# EAGLE design testsmd (EAGLE 9.5.1)
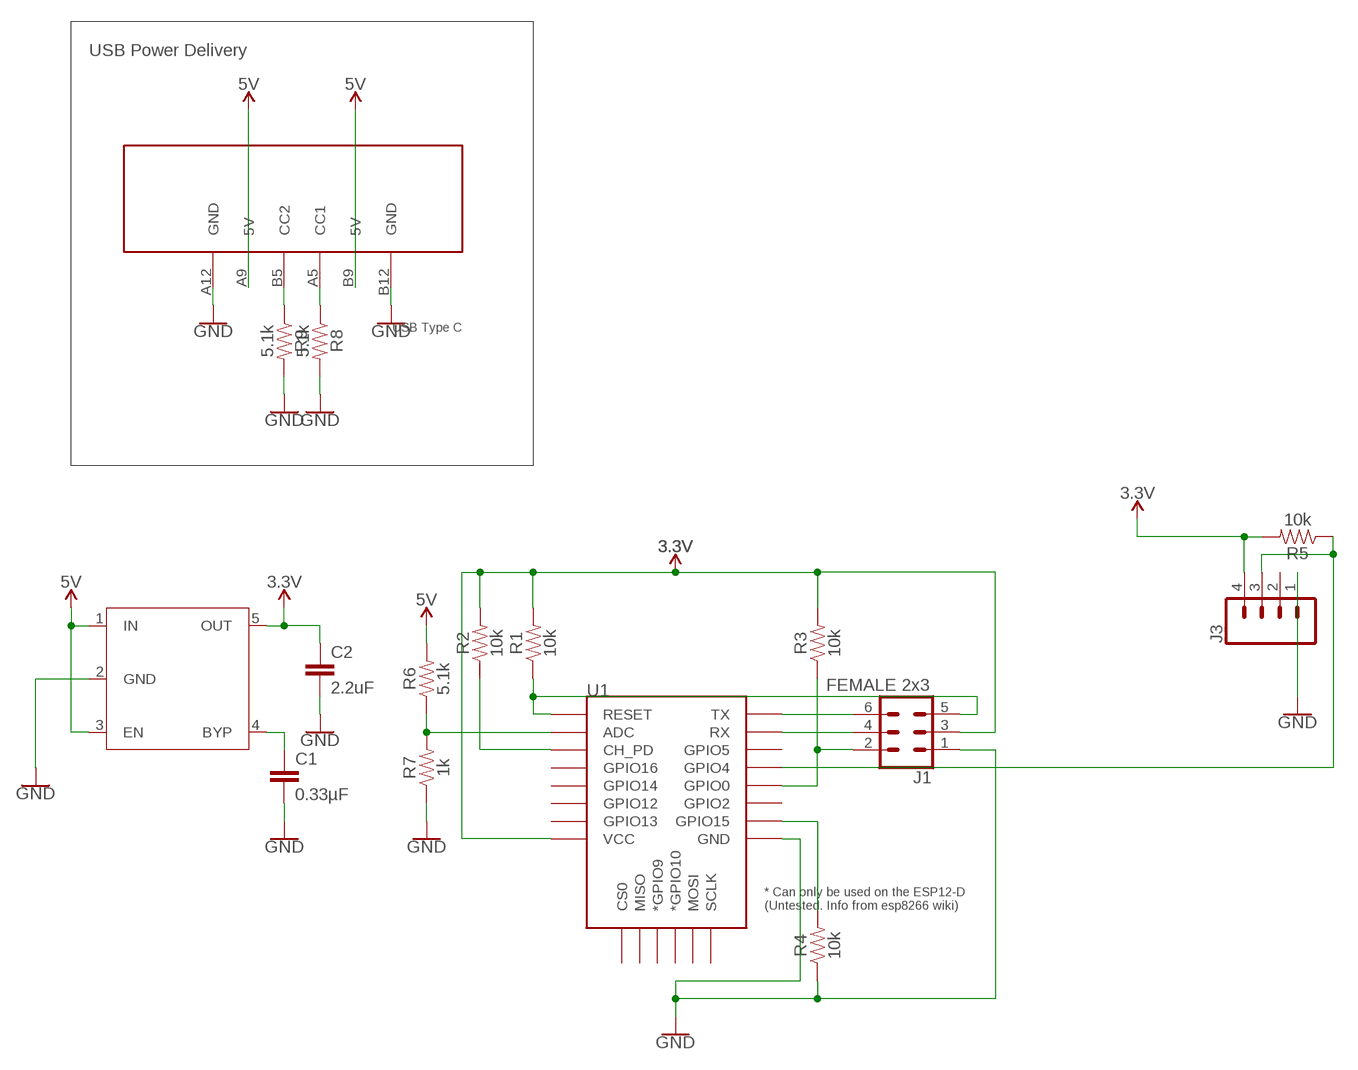
[diagram p0: schematic, sheet 1]

## Parts
C1  0.33µF  0.33UF/330NF-0805-50V-10%  [0805]
C2  2.2uF  2.2UF-1206-50V-10%  [1206]
J1  FEMALE 2x3  CONN_03X2FEMALE  [2X3]
J3  CONN_04  [1X04]
R1  10k  0.75OHM-0805-1/4W-1%  [0805]
R2  10k  0.75OHM-0805-1/4W-1%  [0805]
R3  10k  0.75OHM-0805-1/4W-1%  [0805]
R4  10k  0.75OHM-0805-1/4W-1%  [0805]
R5  10k  0.75OHM-0805-1/4W-1%  [0805]
R6  5.1k  0.75OHM-0805-1/4W-1%  [0805]
R7  1k  0.75OHM-0805-1/4W-1%  [0805]
R8  5.1k  0.75OHM-0805-1/4W-1%  [0805]
R9  5.1k  0.75OHM-0805-1/4W-1%  [0805]
U1  ESP12ESMD  [ESP12E-SMD]
U$1  MIC5219  [SOT95P280X145-5N]
U$3  USBC6PIN  [USBC6PIN]

## Nets
3.3V: C2.1 J1.3 J3.4 R1.2 R2.2 R3.2 R5.2 U1.VCC U$1.5(OUT)
5V: R6.2 U$1.1(IN) U$1.3(EN) U$3.A9(5V) U$3.B9(5V)
GND: C1.2 C2.2 J1.1 J3.1 R4.1 R7.1 R8.2 R9.2 U1.GND U$1.2(GND) U$3.A12(GND) U$3.B12(GND)
N$1: R4.2 U1.GPIO15
N$2: J1.6 U1.TXD0(TX)
N$3: J1.5 R1.1 U1.RESET
N$4: R2.1 U1.CH_PD
N$5: J1.2 R3.1 U1.GPIO0
N$6: J1.4 U1.RXD0(RX)
N$7: J3.3 R5.1 U1.GPIO4
N$8: C1.1 U$1.4(BYP)
N$9: R6.1 R7.2 U1.ADC
N$11: R9.1 U$3.B5(CC2)
N$12: R8.1 U$3.A5(CC1)
Unconnected: J3.2 U1.CS0 U1.GPIO2 U1.GPIO5 U1.GPIO9(*GPIO9) U1.GPIO10(*GPIO10) U1.GPIO12 U1.GPIO13 U1.GPIO14 U1.GPIO16 U1.MISO U1.MOSI U1.SCLK

## Notes on the sheet
- USB Power Delivery

## Library data of the parts
C1 = SparkFun-Capacitors:0.33UF/330NF: 0.33µF/330nF ceramic capacitors A capacitor is a passive two-terminal electrical component used to store electrical energy temporarily in an electric field.; PROD_ID: CAP-08469
C2 = SparkFun-Capacitors:2.2UF: 2.2µF ceramic capacitors A capacitor is a passive two-terminal electrical component used to store electrical energy temporarily in an electric field.; PROD_ID: CAP-10009
J1 = SparkFun-Connectors:CONN_03X2: Multi connection point. Often used as Generic Header-pin footprint for 0.1 inch spaced/style header connections You can populate with any combo of single row headers, but if you'd like an exact match, check these: Header - 2x3 (Male, 0.1") <https://www.sparkfun.com/products/12807> (PRT-12807) Header - 2x3 (Female, 0.1") <https://www.sparkfun.com/products/13010> (PRT-13010) 2x3 Pin Shrouded Header <https://www.sparkfun.com/products/10877> (PRT-10877) On any of the 0.1 inch spaced packages, you can populate with these: Break Away Headers - Straight <https://www.sparkfun.com/products/116> (PRT-00116) Break Away Male Headers - Right Angle <https://www.sparkfun.com/products/553> (PRT-00553) Female Headers <https://www.sparkfun.com/products/115> (PRT-00115) Break Away Headers - Machine Pin <https://www.sparkfun.com/products/117> (PRT-00117) Break Away Female Headers - Swiss Machine Pin <https://www.sparkfun.com/products/743> (PRT-00743) Special note: the shrouded connector mates well with our 3x2 ribbon cables: Ribbon Crimp Connector - 6-pin (2x3, Female) <https://www.sparkfun.com/products/10651> (PRT-10651) Ribbon Cable - 6 wire (15ft) <https://www.sparkfun.com/products/10646> (PRT-10646); PROD_ID: CONN-11566
J3 = SparkFun-Connectors:CONN_04: Multi connection point. Often used as Generic Header-pin footprint for 0.1 inch spaced/style header connections On any of the 0.1 inch spaced packages, you can populate with these: Break Away Headers - Straight <https://www.sparkfun.com/products/116> (PRT-00116) Break Away Male Headers - Right Angle <https://www.sparkfun.com/products/553> (PRT-00553) Female Headers <https://www.sparkfun.com/products/115> (PRT-00115) Break Away Headers - Machine Pin <https://www.sparkfun.com/products/117> (PRT-00117) Break Away Female Headers - Swiss Machine Pin <https://www.sparkfun.com/products/743> (PRT-00743) For SCREWTERMINALS and SPRING TERMINALS visit here: Screw Terimnals on SparkFun.com <https://www.sparkfun.com/search/results?term=Screw+Terminals> (5mm/3.5mm/2.54mm spacing) This device is also useful as a general connection point to wire up your design to another part of your project. Our various solder wires solder well into these plated through hole pads. Hook-Up Wire - Assortment (Stranded, 22 AWG) <https://www.sparkfun.com/products/11375> (PRT-11375) Hook-Up Wire - Assortment (Solid Core, 22 AWG) <https://www.sparkfun.com/products/11367> (PRT-11367) View the entire wire category on our website here <https://www.sparkfun.com/categories/141> Special notes: Molex polarized connector foot print use with SKU : PRT-08231 with associated crimp pins and housings. 1MM SMD Version SKU: PRT-10208; PROD_ID: CONN-09696
R1-R9 = SparkFun-Resistors:0.75OHM: 0.75Ω resistor A resistor is a passive two-terminal electrical component that implements electrical resistance as a circuit element. Resistors act to reduce current flow, and, at the same time, act to lower voltage levels within circuits. - Wikipedia; PROD_ID: RES-08474; VALUE: 0.75
U1 = esp8266modules:ESP12E: ESP12E Module
U$1 = SOT95P280X145-5N:MIC5219
U$3 = usbc6pin:USBC6PIN

## Board
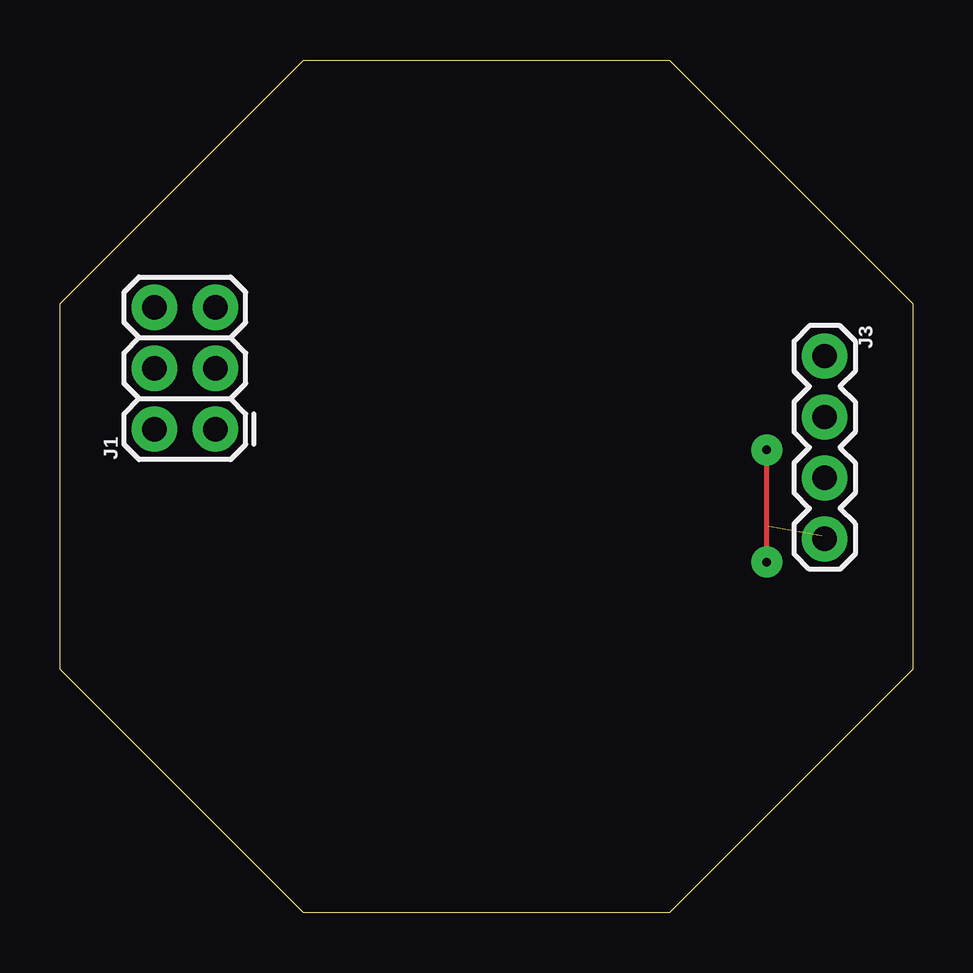
[diagram p1: board, top side]
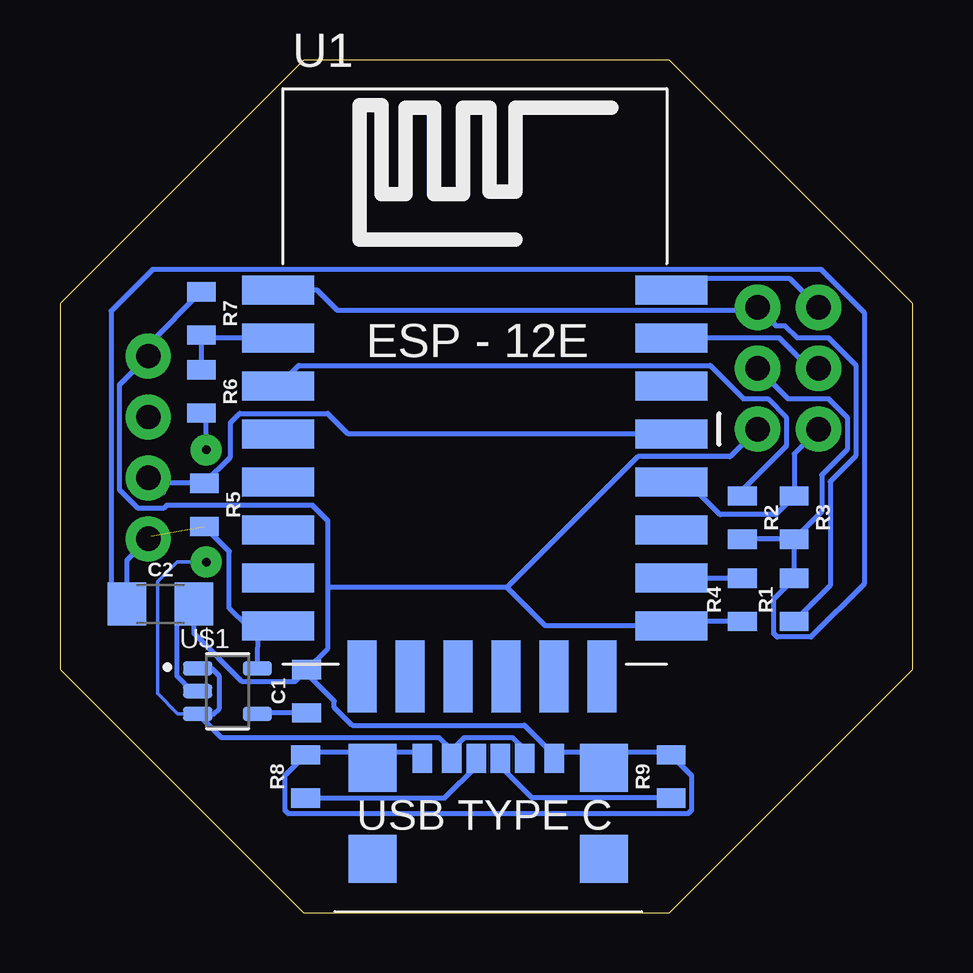
[diagram p2: board, bottom side, seen from below]

Size 35.56 x 35.56 mm. Coordinates in mm from the lower left corner, seen from the top.
Outline: 25.4,0 10.16,0 0,10.16 0,25.4 10.16,35.56 25.4,35.56 35.56,25.4 35.56,10.16 25.4,0
Copper layers (1*16): Top 0.035mm / dielectric 1.5mm / Bottom 0.035mm
Design rules "default": minimum track width 6mil, minimum drill 0.35mm, track to track 6mil, track to pad 6mil, pad to pad 6mil, via to via 6mil, smd to smd 6mil, copper to edge 40mil, drill to drill 6mil, minimum pad ring 10mil, minimum via ring 8mil, stop-mask expansion 4mil, vias tented up to drill 0mil, thermal gap 10mil

### Footprints (pad centres in the part's own frame; a part is rotated, then mirrored left to right if it is on the bottom)
0805 = smd 0.8 x 1.2: 1 -0.9,0; 2 0.9,0
1206 = smd 1.6 x 1.8: 1 -1.4,0; 2 1.4,0
2X3 = drill 1.016 pad 1.88: 1 0,0; 2 0,2.54; 3 2.54,0; 4 2.54,2.54; 5 5.08,0; 6 5.08,2.54
1X04 = drill 1.016 pad 1.88: 1 0,0; 2 2.54,0; 3 5.08,0; 4 7.62,0
ESP12E-SMD = smd 3 x 1.2: ADC -8.3,3.8; CH_PD -8.3,1.8; GND 8.1,-8.2; GPIO0 8.1,-2.2; GPIO2 8.1,-4.2; GPIO4 8.1,-0.2; GPIO5 8.1,1.8; GPIO12 -8.3,-4.2; GPIO13 -8.3,-6.2; GPIO14 -8.3,-2.2; GPIO15 8.1,-6.2; GPIO16 -8.3,-0.2; RESET -8.3,5.8; RXD0 8.1,3.8; TXD0 8.1,5.8; VCC -8.3,-8.2 | smd 1.2 x 3: CS0 -4.8,-10.3; GPIO9 -0.8,-10.3; GPIO10 1.2,-10.3; MISO -2.8,-10.3; MOSI 3.2,-10.3; SCLK 5.2,-10.3
SOT95P280X145-5N = smd 1.22 x 0.6: 1 -1.245,0.95; 2 -1.245,0; 3 -1.245,-0.95; 4 1.245,-0.95; 5 1.245,0.95
USBC6PIN = smd 0.8 x 1.2: A5 -0.5,0; A9 1.52,0; A12 2.75,0; B5 0.5,0; B9 -1.52,0; B12 -2.75,0 | smd 2 x 2: P$7 4.82,-0.4; P$8 -4.82,-0.4; P$9 4.82,-4.2; P$10 -4.82,-4.2

### Placement (x,y rotation side)
C1  25.27,9.25 90 bottom
C2  31.37,12.88 0 bottom
J1  6.48,20.17 90 top
J3  31.88,23.22 270 top
R1  4.95,13.06 90 bottom
R2  7.11,16.48 270 bottom
R3  4.95,16.48 270 bottom
R4  7.11,13.06 90 bottom
R5  29.54,17.02 270 bottom
R6  29.67,21.74 270 bottom
R7  29.67,24.99 270 bottom
R8  25.32,5.69 90 bottom
R9  10.08,5.69 90 bottom
U1  18.16,20.17 0 bottom
U$1  28.57,9.25 0 bottom
U$3  17.7,6.45 0 bottom

### Tracks (layer width: path | path; a pad name or v marks a point on that pad's centre or on a via)
3.3V  (1 unrouted)
  Bottom 0.203: 31.76,15.71 J3.4 32.77,14.7 C2.1 33.43,13.54 33.43,25.09 31.7,26.82 3.82,26.82 2.03,25.03 2.03,13.72 4.25,11.5 5.66,11.5 5.81,11.65 5.81,13.1 R1.2 | 27.3,11.97 U1.VCC 27.77,11.97 28.5,12.7 28.5,15.08 R5.2 | 27.3,11.97 27.43,11.97 27.37,11.9 | J1.3 5.21,21.44 3.52,21.44 2.74,20.66 2.74,19.33 3.81,18.26 3.81,16.73 R3.2 | 4.92,13.96 R1.2 | R1.2 R3.2 | R3.2 R2.2 | U$1.5 27.3,11.97
5V  (via drill 0.35 pad 1.3)
  Top 0.203: v29.46,14.63 v29.46,19.3
  Bottom 0.152: U$1.3 30.65,8.3 31.5,9.14 31.5,13.82 30.68,14.63 v29.46,14.63
  Bottom 0.203: U$1.1 29.25,10.2 28.91,9.86 28.91,8.53 29.14,8.3 U$1.3 28.84,7.32 19.75,7.32 19.22,6.79 | U$3.A9 16.18,6.79 16.7,7.31 18.71,7.31 19.22,6.79 | 19.22,6.79 U$3.B9 | v29.46,19.3 29.46,20.64 R6.2
GND
  Bottom 0.203: 10.06,11.91 U1.GND 15.33,11.97 16.92,13.56 | J1.1 7.62,19.02 11.46,19.02 16.92,13.56 | 8.76,11.91 9.65,11.91 | 9.65,11.91 10.06,11.91 | 9.4,11.66 9.65,11.91 | 14.95,6.66 U$3.A12 | 24.38,13.56 24.38,11.04 C1.2 25.36,10.06 | 25.36,10.06 25.78,9.64 27.96,9.64 29.97,11.65 C2.2 30.68,12.16 30.68,9.88 30.05,9.25 U$1.2 | 14.95,6.66 14.92,6.7 10.19,6.7 R9.2 9.23,5.74 9.23,4.28 9.38,4.14 26.03,4.14 26.18,4.28 26.18,5.74 R8.2 25.22,6.7 20.7,6.7 U$3.B12 | 25.36,10.06 24.13,8.84 24.13,8.58 23.38,7.82 16.2,7.82 15.04,6.66 14.95,6.66 | 16.92,13.56 24.38,13.56 | R4.1 9.82,12.16 10.06,11.91 | 24.38,13.56 24.38,16.35 25.03,16.99 31.11,16.99 31.24,16.87 32.3,16.87 33.07,17.64 33.07,22.02 J3.1 31.88,23.68 R7.1
N$1
  Bottom 0.203: 11.03,13.97 U1.GPIO15 10.05,13.96 R4.2
N$2
  Bottom 0.203: J1.6 5.13,26.44 9.59,26.44 U1.TXD0
N$3
  Bottom 0.203: U1.RESET 24.85,25.97 24,25.11 6.61,25.11 J1.5 5.71,24.49 5.33,24.49 4.83,23.98 3.52,23.98 2.39,22.85 2.39,19.05 3.45,17.98 3.45,13.65 R1.1
N$4
  Bottom 0.203: R2.1 7.11,17.63 5.28,19.46 5.28,20.66 6.06,21.44 7.07,21.44 8.46,22.82 25.61,22.82 U1.CH_PD
N$5
  Bottom 0.203: 8.85,17.97 9.14,17.97 | 9.14,17.97 9.4,17.97 | 9.4,17.97 U1.GPIO0 | 9.14,17.88 9.14,17.97 | J1.2 4.95,19.15 R3.1 5.73,16.61 8.04,16.61 9.4,17.97
N$6
  Bottom 0.203: U1.RXD0 5.58,23.97 4.32,22.71 J1.4
N$7
  Bottom 0.203: 31.25,17.51 J3.3 31.66,17.92 R5.1 28.45,19.01 28.45,20.44 28.07,20.82 24.4,20.82 23.55,19.97 U1.GPIO4
N$8
  Bottom 0.203: C1.1 27.28,8.35 U$1.4
N$9
  Bottom 0.203: U1.ADC 29.54,23.97 R7.2 R6.1
N$11
  Bottom 0.203: R9.1 15.88,4.79 17.2,6.11 U$3.B5
N$12
  Bottom 0.203: R8.1 19.53,4.79 18.2,6.11 U$3.A5